# EAGLE schematic BMS_Rev2_logic (EAGLE 7.0.0)
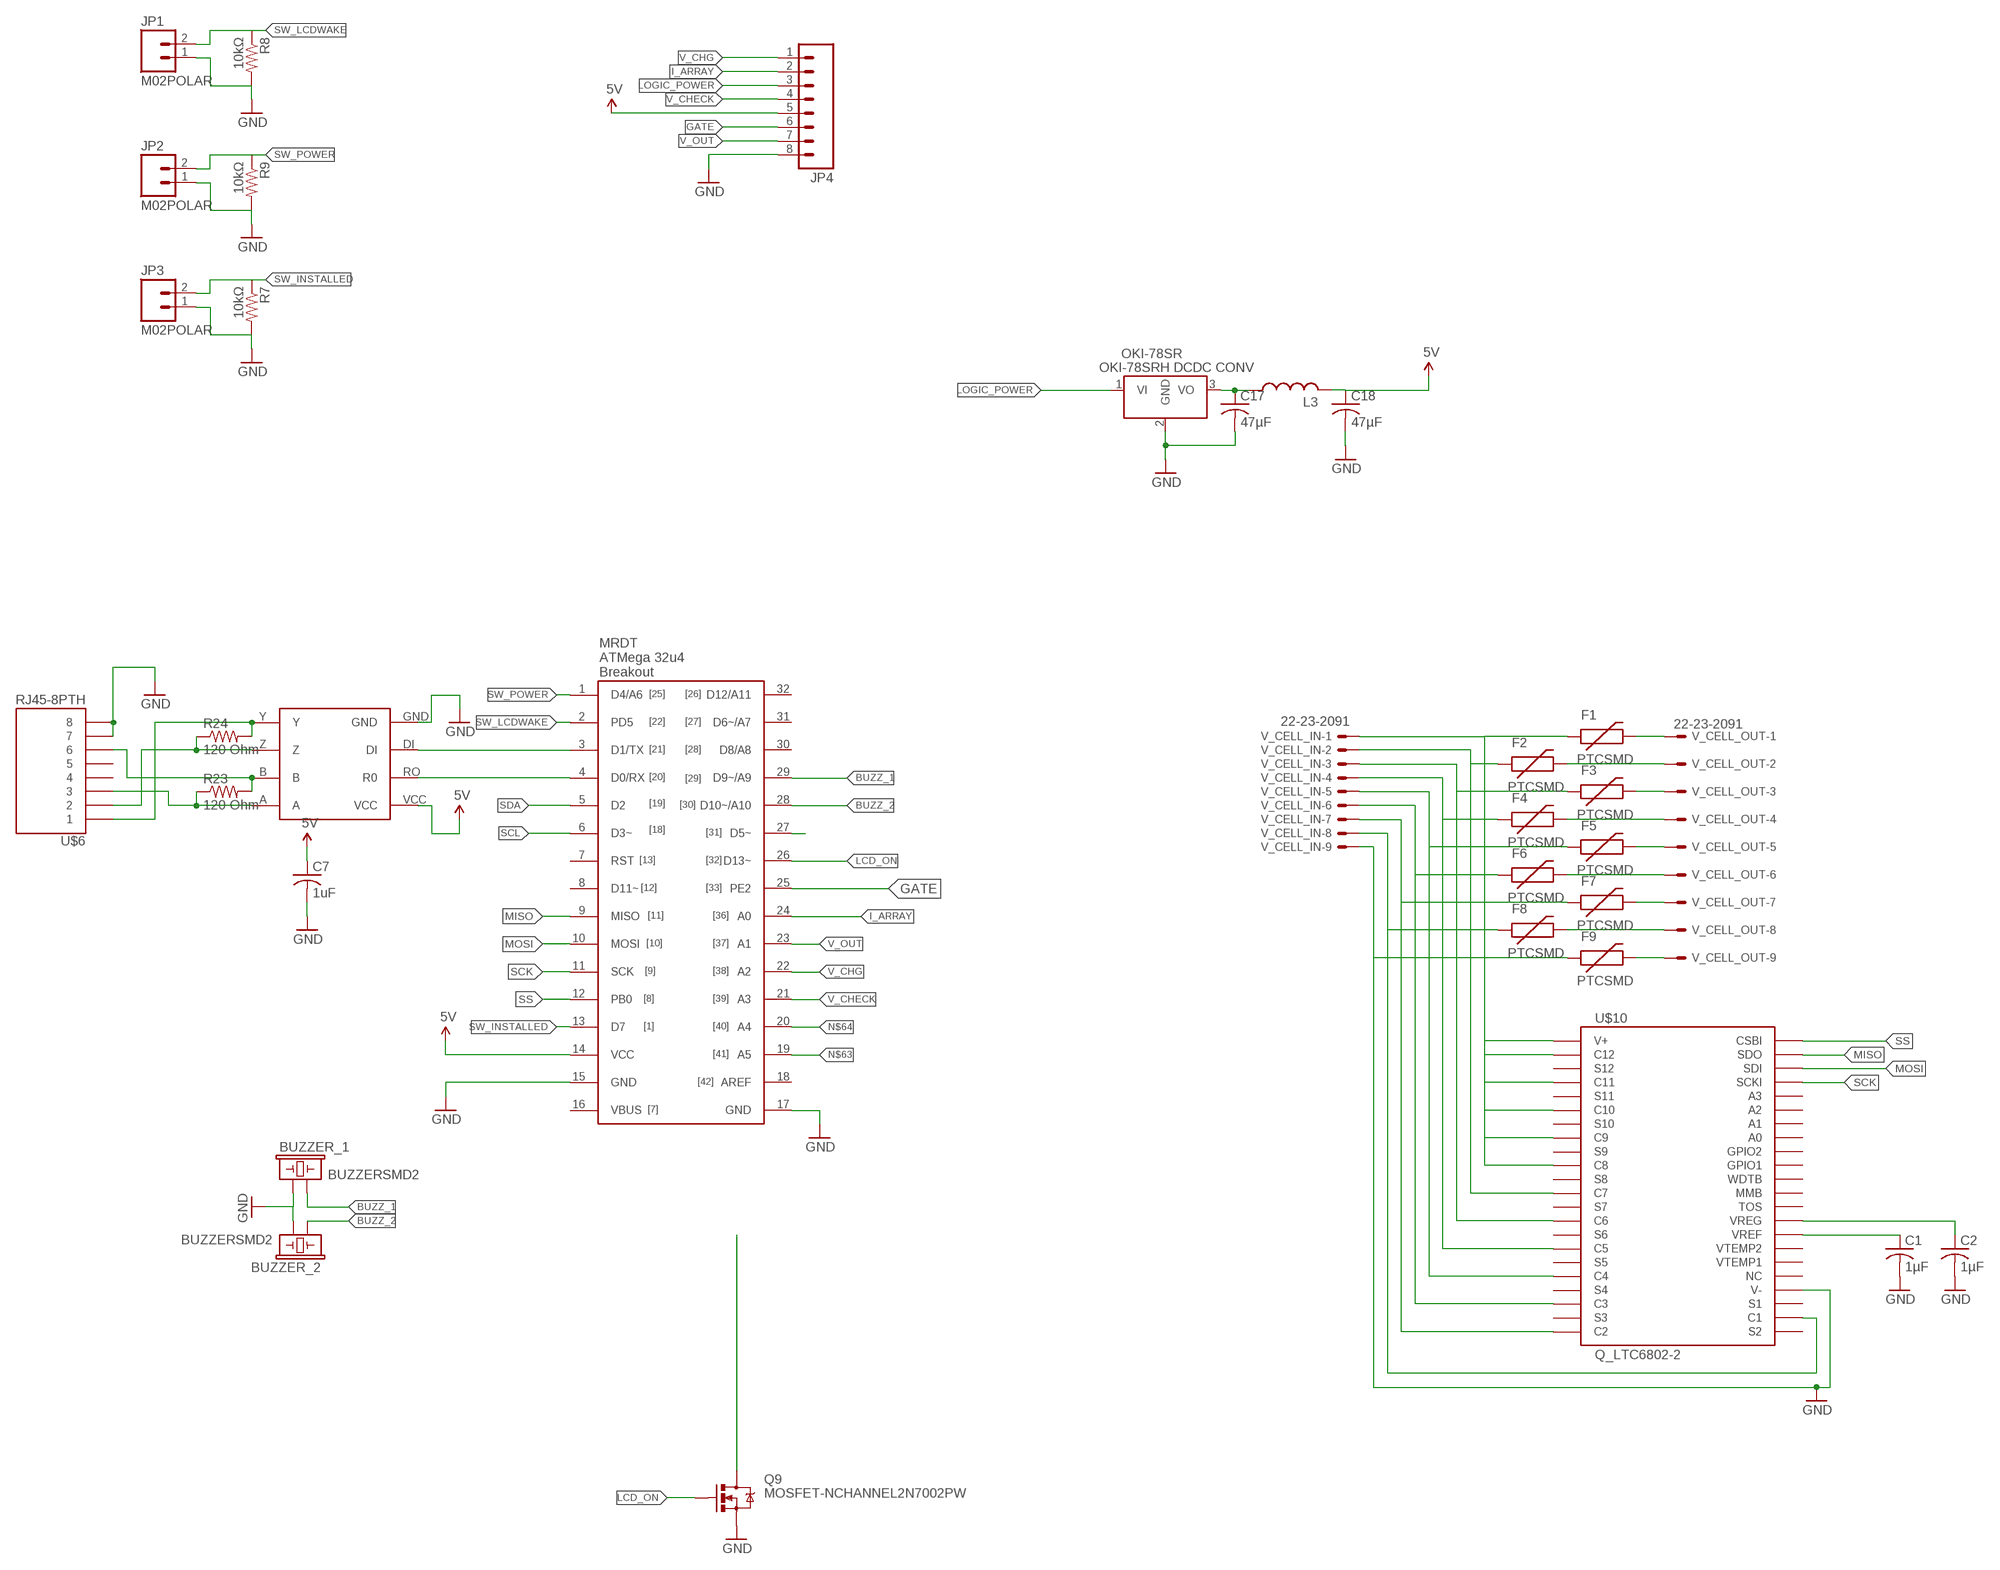
[diagram p0: schematic, sheet 1]

## Parts
BUZZER_1  BUZZERSMD2  [BUZZER-CCV]
BUZZER_2  BUZZERSMD2  [BUZZER-CCV]
C1  1µF  C-USC1206  [C1206]
C2  1µF  C-USC1206  [C1206]
C7  1uF  C-USC1206  [C1206]
C17  47µF  C-USC1206  [C1206]
C18  47µF  C-USC1206  [C1206]
F1  PTCSMD  [PTC-1206]
F2  PTCSMD  [PTC-1206]
F3  PTCSMD  [PTC-1206]
F4  PTCSMD  [PTC-1206]
F5  PTCSMD  [PTC-1206]
F6  PTCSMD  [PTC-1206]
F7  PTCSMD  [PTC-1206]
F8  PTCSMD  [PTC-1206]
F9  PTCSMD  [PTC-1206]
JP1  M02POLAR  [MOLEX-1X2]
JP2  M02POLAR  [MOLEX-1X2]
JP3  M02POLAR  [MOLEX-1X2]
JP4  M08BM08B-SRSS-TB  [BM08B-SRSS-TB]
L3  L-USL3216C  [L3216C]
OKI-78SR  Q_OKI-78SR  [OKI-78SRH]
Q9  MOSFET-NCHANNEL2N7002PW  [SOT323]
R7  10kΩ  R-US_R1206  [R1206]
R8  10kΩ  R-US_R1206  [R1206]
R9  10kΩ  R-US_R1206  [R1206]
R23  120 Ohm  RESISTOR1206  [1206]
R24  120 Ohm  RESISTOR1206  [1206]
U$3  32U4_BREAKOUT  [32U4_MCU_DIP]
U$6  RJ45-8PTH  [RJ45-8]
U$9  MAX3077  [MAX3070E]
U$10  Q_LTC6802-2  [SSOP44]
V_CELL_IN  22-23-2091  [22-23-2091]
V_CELL_OUT  22-23-2091  [22-23-2091]

## Nets
5V: C7.1 C18.1 JP4.5 L3.2 U$3.14(VCC) U$9.VCC
BUZZ_1: BUZZER_1.- U$3.29(D9~/A9)
BUZZ_2: BUZZER_2.+ U$3.28(D10~/A10)
GATE: JP4.6 U$3.25(PE2)
GND: BUZZER_1.+ BUZZER_2.- C1.2 C2.2 C7.2 C17.2 C18.2 F9.1 JP1.1 JP2.1 JP3.1 JP4.8 OKI-78SR.2(GND) Q9.2(S) R7.2 R8.2 R9.2 U$3.15(GND) U$3.17(GND) U$6.7 U$6.8 U$9.GND U$10.26(V-) V_CELL_IN.9
I_ARRAY: JP4.2 U$3.24(A0)
LCD_DB4: U$3.27(D5~)
LCD_ON: Q9.1(G) U$3.26(D13~)
LOGIC_POWER: JP4.3 OKI-78SR.1(VI)
MISO: U$3.9(MISO) U$10.43(SDO)
MOSI: U$3.10(MOSI) U$10.42(SDI)
N$1: F1.2 V_CELL_OUT.1
N$2: F2.2 V_CELL_OUT.2
N$3: F3.2 V_CELL_OUT.3
N$4: F9.2 V_CELL_OUT.9
N$6: R24.2 U$6.1 U$9.Y
N$7: R24.1 U$6.2 U$9.Z
N$9: R23.2 U$6.6 U$9.B
N$10: R23.1 U$6.3 U$9.A
N$11: U$3.3(D1/TX) U$9.DI
N$12: C1.1 U$10.30(VREF)
N$13: C2.1 U$10.31(VREG)
N$14: F4.2 V_CELL_OUT.4
N$15: F5.2 V_CELL_OUT.5
N$16: F6.2 V_CELL_OUT.6
N$17: F7.2 V_CELL_OUT.7
N$18: F8.2 V_CELL_OUT.8
N$32: Q9.3(D)
N$41: F1.1 U$10.1(V+) U$10.2(C12) U$10.4(C11) U$10.6(C10) U$10.8(C9) U$10.10(C8) V_CELL_IN.1
N$42: F2.1 U$10.12(C7) V_CELL_IN.2
N$43: F3.1 U$10.14(C6) V_CELL_IN.3
N$46: F6.1 U$10.20(C3) V_CELL_IN.6
N$47: F7.1 U$10.22(C2) V_CELL_IN.7
N$48: F8.1 U$10.24(C1) V_CELL_IN.8
N$63: U$3.19(A5)
N$64: U$3.20(A4)
N$89: F4.1 U$10.16(C5) V_CELL_IN.4
N$91: F5.1 U$10.18(C4) V_CELL_IN.5
N$100: C17.1 L3.1 OKI-78SR.3(VO)
RXD: U$3.4(D0/RX) U$9.RO(R0)
SCK: U$3.11(SCK) U$10.41(SCKI)
SCL: U$3.6(D3~)
SDA: U$3.5(D2)
SS: U$3.12(PB0) U$10.44(CSBI)
SW_INSTALLED: JP3.2 R7.1 U$3.13(D7)
SW_LCDWAKE: JP1.2 R8.1 U$3.2(PD5)
SW_POWER: JP2.2 R9.1 U$3.1(D4/A6)
V_CHECK: JP4.4 U$3.21(A3)
V_CHG: JP4.1 U$3.22(A2)
V_OUT: JP4.7 U$3.23(A1)
Unconnected: U$3.7(RST) U$3.8(D11~) U$3.16(VBUS) U$3.18(AREF) U$3.30(D8/A8) U$3.31(D6~/A7) U$3.32(D12/A11) U$6.4 U$6.5 U$10.3(S12) U$10.5(S11) U$10.7(S10) U$10.9(S9) U$10.11(S8) U$10.13(S7) U$10.15(S6) U$10.17(S5) U$10.19(S4) U$10.21(S3) U$10.23(S2) U$10.25(S1) U$10.27(NC) U$10.28(VTEMP1) U$10.29(VTEMP2) U$10.32(TOS) U$10.33(MMB) U$10.34(WDTB) U$10.35(GPIO1) U$10.36(GPIO2) U$10.37(A0) U$10.38(A1) U$10.39(A2) U$10.40(A3)

## Library data of the parts
BUZZER_1 BUZZER_2 = SparkFun-Electromechanical:BUZZER: Buzzer 12mm Spark Fun Electronics SKU : Comp-Buzzer
C1 C2 C7 C17 C18 = resistor:C-US: CAPACITOR, American symbol
F1-F9 = SparkFun-PowerIC:PTC: Resettable Fuse PTC Resettable Fuse. Spark Fun Electronics SKU : COM-08357; PROD_ID: RES-11150
JP1-JP3 = SparkFun-Connectors:M02: Standard 2-pin 0.1" header. Use with - straight break away headers ( PRT-00116) - right angle break away headers (PRT-00553) - swiss pins (PRT-00743) - machine pins (PRT-00117) - female headers (PRT-00115) Molex polarized connector foot print use with: PRT-08233 with associated crimp pins and housings. 2.54_SCREWTERM for use with PRT-10571. 3.5mm Screw Terminal footprints for PRT-08084 5mm Screw Terminal footprints for use with PRT-08433
JP4 = SparkFun-Connectors:M08: Header 8 Standard 8-pin 0.1" header. Use with straight break away headers (SKU : PRT-00116), right angle break away headers (PRT-00553), swiss pins (PRT-00743), machine pins (PRT-00117), and female headers (PRT-00115).
L3 = resistor:L-US: INDUCTOR, American symbol
OKI-78SR = MRDT-2015-PowerBoard:Q_OKI-78SR: 4.95W DC/DC Converter Manufacturer: Murata Part Number: OKI-78SR-5/1.5-W36H-C OKI-78SR-3.3/1.5-W36H-C
Q9 = SparkFun-DiscreteSemi:MOSFET-NCHANNEL: Common NMOSFET Parts MFG P/N Store ID Prod ID FDD8780 TRANS-09984 SI7820DN TRANS-11055 FDS6630A IC-08089 2N7002PW TRANS-11151 FQP30N06L COM-10213 TRANS-10060 BSS123LT1G TRANS-08345 BSS138 TRANS-00830 BS170 2N7000; PROD_ID: TRANS-11151
R7-R9 = resistor:R-US_: RESISTOR, American symbol
R23 R24 = SparkFun-Passives:RESISTOR: Resistor Basic schematic elements and footprints for 0603, 1206, and PTH resistors.
U$3 = MRDT-2015-General:32U4_BREAKOUT
U$6 = SparkFun-Connectors:RJ45-8: RJ45 Jack Simple RJ45, 8-pin connection - connector for common Cat5, Cat5e, and Cat6 Ethernet cables. Footprint not yet proven in production. Connector sku is PRT-00643; Breakout PCB sku is BOB-00716.
U$9 = MAX3077:MAX3077
U$10 = MRDT-2015-BMS:Q_LTC6802-2
V_CELL_IN V_CELL_OUT = con-molex:22-23-2091: .100" (2.54mm) Center Header - 9 Pin; MF: MOLEX; MPN: 22-23-2091; OC_FARNELL: 1756827; OC_NEWARK: 56H0450